# EAGLE design robotito (EAGLE 7.7.0)
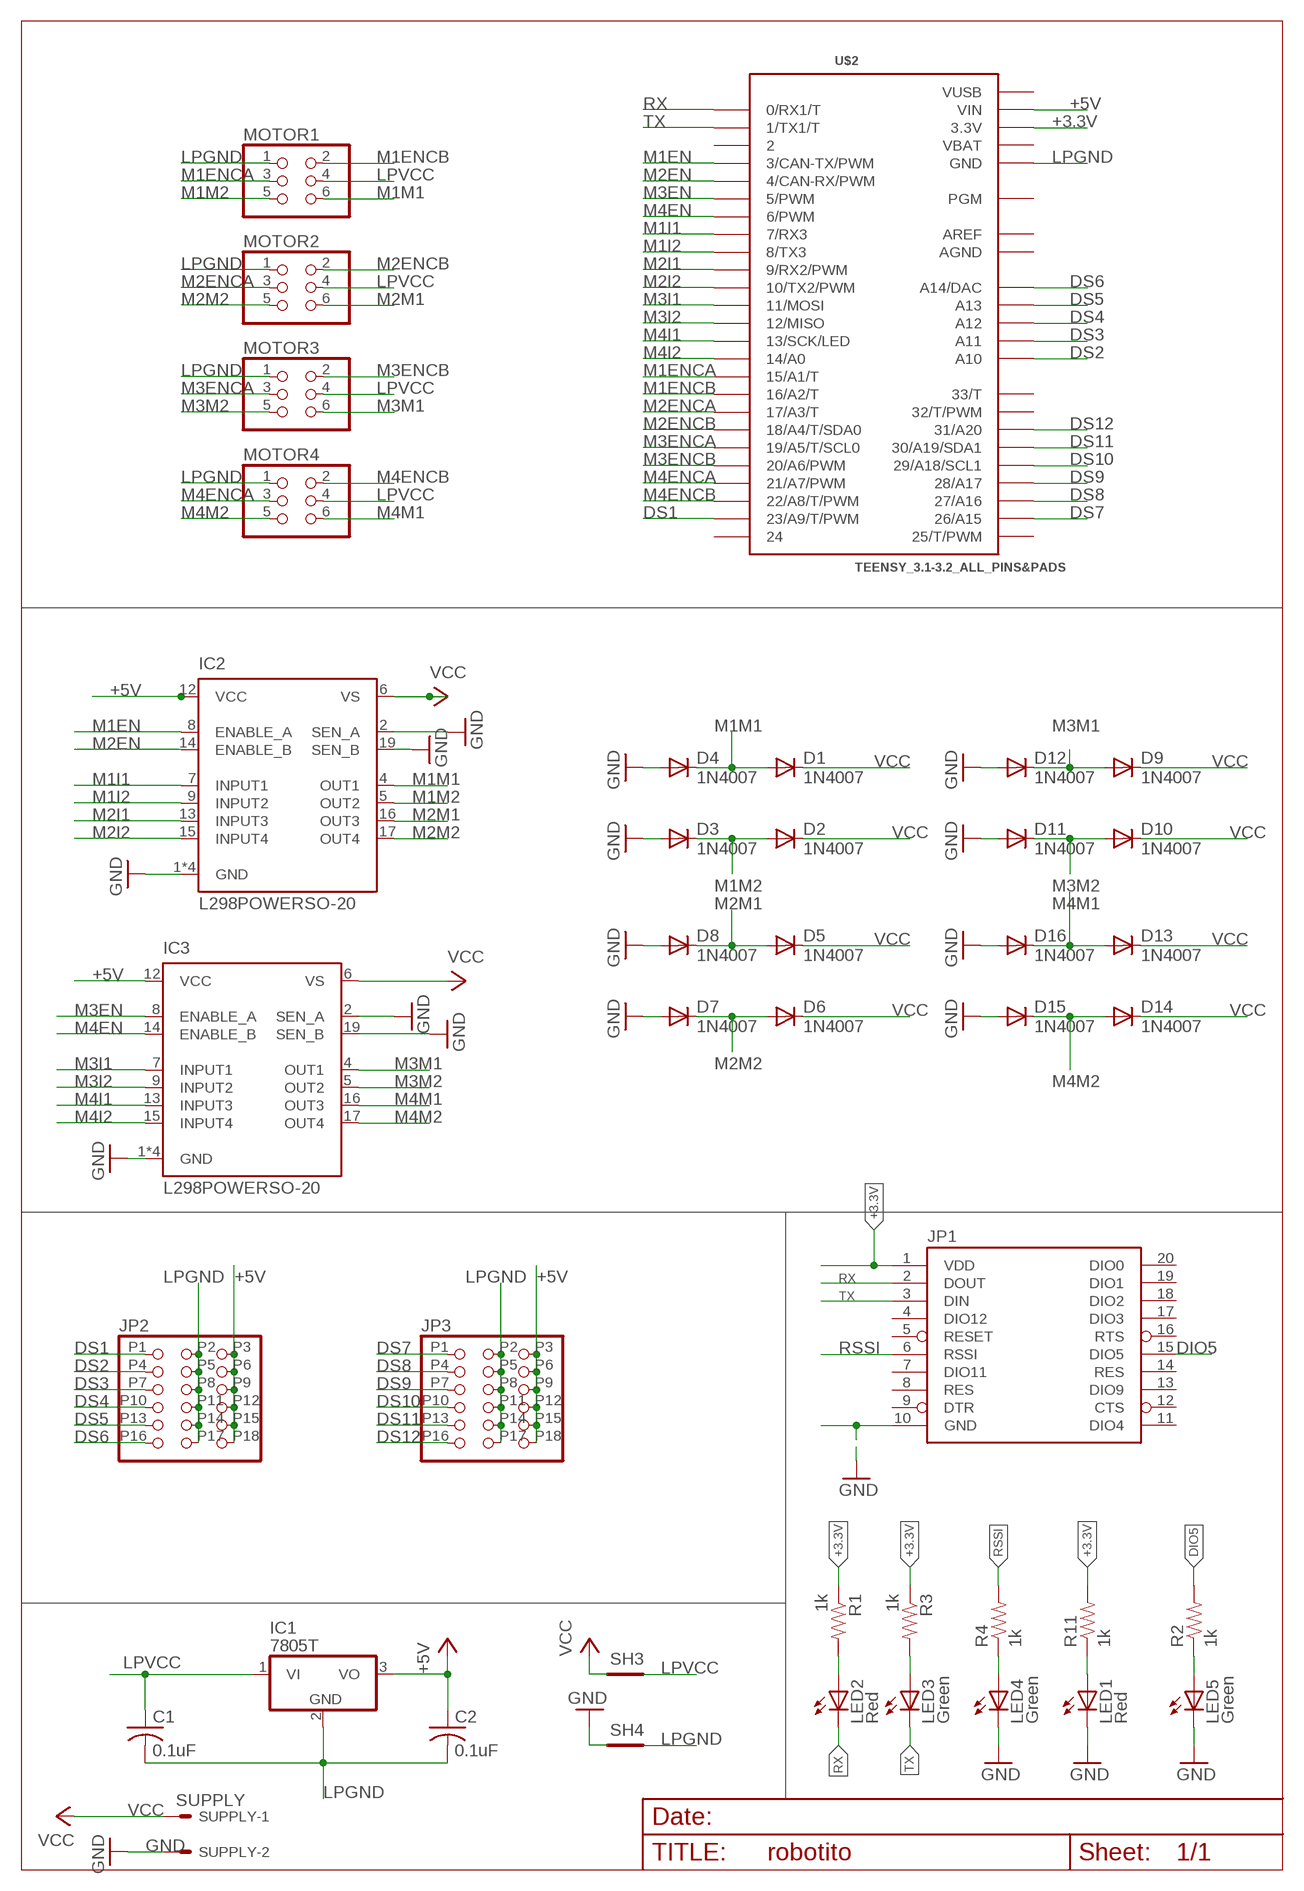
[diagram p0: schematic, sheet 1]

## Parts
C1  0.1uF  C-USC0805  [C0805]
C2  0.1uF  C-USC0805  [C0805]
D1  1N4007  1N4004  [DO41-10]
D2  1N4007  1N4004  [DO41-10]
D3  1N4007  1N4004  [DO41-10]
D4  1N4007  1N4004  [DO41-10]
D5  1N4007  1N4004  [DO41-10]
D6  1N4007  1N4004  [DO41-10]
D7  1N4007  1N4004  [DO41-10]
D8  1N4007  1N4004  [DO41-10]
D9  1N4007  1N4004  [DO41-10]
D10  1N4007  1N4004  [DO41-10]
D11  1N4007  1N4004  [DO41-10]
D12  1N4007  1N4004  [DO41-10]
D13  1N4007  1N4004  [DO41-10]
D14  1N4007  1N4004  [DO41-10]
D15  1N4007  1N4004  [DO41-10]
D16  1N4007  1N4004  [DO41-10]
IC1  7805T  [TO220H]
IC2  L298POWERSO-20  [POWERSO-20]
IC3  L298POWERSO-20  [POWERSO-20]
JP1  XBEE-1B1  [XBEE-1]
JP2  PINHD-2X6  [2X06]
JP3  PINHD-2X6  [2X06]
LED1  Red  LED-RED0603  [LED-0603]
LED2  Red  LED-RED0603  [LED-0603]
LED3  Green  LED-GREEN0603  [LED-0603]
LED4  Green  LED-GREEN0603  [LED-0603]
LED5  Green  LED-GREEN0603  [LED-0603]
MOTOR1  PINHD-2X3  [2X03]
MOTOR2  PINHD-2X3  [2X03]
MOTOR3  PINHD-2X3  [2X03]
MOTOR4  PINHD-2X3  [2X03]
R1  1k  1KOHM1/10W1%(0603)  [0603-RES]
R2  1k  1KOHM1/10W1%(0603)  [0603-RES]
R3  1k  1KOHM1/10W1%(0603)  [0603-RES]
R4  1k  1KOHM1/10W1%(0603)  [0603-RES]
R11  1k  1KOHM1/10W1%(0603)  [0603-RES]
SH3  SHORT-HT5  [SHORT_TOP-50]
SH4  SHORT-HT5  [SHORT_TOP-50]
SUPPLY  SUPPLY  22-27-2021-02  [6410-02]
U$2  TEENSY_3.1-3.2_ALL_PINS&PADS  [TEENSY_3.0-3.2_ALL_PINS_&_PADS]

## Nets
+3.3V: JP1.1(VDD) R1.1 R3.1 R11.2 U$2.3.3V U$2.3.3V1(3.3V) U$2.3.3V2(3.3V)
+5V: C2.1 IC1.3(VO) IC2.12(VCC) IC3.12(VCC) JP2.P3 JP2.P6 JP2.P9 JP2.P12 JP2.P15 JP2.P18 JP3.P3 JP3.P6 JP3.P9 JP3.P12 JP3.P15 JP3.P18 U$2.VIN
DIO5: JP1.15(DIO5) R2.2
DS1: JP2.P1 U$2.23/A9(23/A9/T/PWM)
DS2: JP2.P4 U$2.A10
DS3: JP2.P7 U$2.A11
DS4: JP2.P10 U$2.A12
DS5: JP2.P13 U$2.A13
DS6: JP2.P16 U$2.RESET/DAC(A14/DAC)
DS7: JP3.P1 U$2.26(26/A15)
DS8: JP3.P4 U$2.27(27/A16)
DS9: JP3.P7 U$2.28(28/A17)
DS10: JP3.P10 U$2.29(29/A18/SCL1)
DS11: JP3.P13 U$2.30(30/A19/SDA1)
DS12: JP3.P16 U$2.31(31/A20)
GND [pwr]: D3.A D4.A D7.A D8.A D11.A D12.A D15.A D16.A IC2.1(GND) IC2.2(SEN_A) IC2.10(GND) IC2.11(GND) IC2.19(SEN_B) IC2.20(GND) IC3.1(GND) IC3.2(SEN_A) IC3.10(GND) IC3.11(GND) IC3.19(SEN_B) IC3.20(GND) JP1.10(GND) LED1.C LED4.C LED5.C SH4.1 SUPPLY.2
LPGND: C1.2 C2.2 IC1.2(GND) JP2.P2 JP2.P5 JP2.P8 JP2.P11 JP2.P14 JP2.P17 JP3.P2 JP3.P5 JP3.P8 JP3.P11 JP3.P14 JP3.P17 MOTOR1.1 MOTOR2.1 MOTOR3.1 MOTOR4.1 SH4.2 U$2.GND U$2.GND1(GND) U$2.GND2(GND)
LPVCC: C1.1 IC1.1(VI) MOTOR1.4 MOTOR2.4 MOTOR3.4 MOTOR4.4 SH3.2
M1EN: IC2.8(ENABLE_A) U$2.3(3/CAN-TX/PWM)
M1ENCA: MOTOR1.3 U$2.15/A1(15/A1/T)
M1ENCB: MOTOR1.2 U$2.16/A2(16/A2/T)
M1I1: IC2.7(INPUT1) U$2.7(7/RX3)
M1I2: IC2.9(INPUT2) U$2.8(8/TX3)
M1M1 [pwr]: D1.A D4.C IC2.4(OUT1) MOTOR1.6
M1M2 [pwr]: D2.A D3.C IC2.5(OUT2) MOTOR1.5
M2EN: IC2.14(ENABLE_B) U$2.4(4/CAN-RX/PWM)
M2ENCA: MOTOR2.3 U$2.17/A3(17/A3/T)
M2ENCB: MOTOR2.2 U$2.18/A4(18/A4/T/SDA0)
M2I1: IC2.13(INPUT3) U$2.9(9/RX2/PWM)
M2I2: IC2.15(INPUT4) U$2.10(10/TX2/PWM)
M2M1 [pwr]: D5.A D8.C IC2.16(OUT3) MOTOR2.6
M2M2 [pwr]: D6.A D7.C IC2.17(OUT4) MOTOR2.5
M3EN: IC3.8(ENABLE_A) U$2.5(5/PWM)
M3ENCA: MOTOR3.3 U$2.19/A5(19/A5/T/SCL0)
M3ENCB: MOTOR3.2 U$2.20/A6(20/A6/PWM)
M3I1: IC3.7(INPUT1) U$2.11(11/MOSI)
M3I2: IC3.9(INPUT2) U$2.12(12/MISO)
M3M1: D9.A D12.C IC3.4(OUT1) MOTOR3.6
M3M2 [pwr]: D10.A D11.C IC3.5(OUT2) MOTOR3.5
M4EN: IC3.14(ENABLE_B) U$2.6(6/PWM)
M4ENCA: MOTOR4.3 U$2.21/A7(21/A7/PWM)
M4ENCB: MOTOR4.2 U$2.22/A8(22/A8/T/PWM)
M4I1: IC3.13(INPUT3) U$2.13(13/SCK/LED)
M4I2: IC3.15(INPUT4) U$2.14/A0
M4M1 [pwr]: D13.A D16.C IC3.16(OUT3) MOTOR4.6
M4M2 [pwr]: D14.A D15.C IC3.17(OUT4) MOTOR4.5
N$12: LED1.A R11.1
N$17: LED2.A R1.2
N$19: LED3.A R3.2
N$43: LED4.A R4.1
N$139: LED5.A R2.1
RSSI: JP1.6(RSSI) R4.2
RX: JP1.2(DOUT) LED2.C U$2.0(0/RX1/T)
TX: JP1.3(DIN) LED3.C U$2.1(1/TX1/T)
VCC [pwr]: D1.C D2.C D5.C D6.C D9.C D10.C D13.C D14.C IC2.6(VS) IC3.6(VS) SH3.1 SUPPLY.1
Unconnected: JP1.4(DIO12) JP1.5(RESET) JP1.7(DIO11) JP1.8(RES) JP1.9(DTR) JP1.11(DIO4) JP1.12(CTS) JP1.13(DIO9) JP1.14(RES) JP1.16(RTS) JP1.17(DIO3) JP1.18(DIO2) JP1.19(DIO1) JP1.20(DIO0) U$2.2 U$2.24 U$2.25(25/T/PWM) U$2.32(32/T/PWM) U$2.33(33/T) U$2.PGM

## Power pins joined to a net without a drawn wire
AGND: U$2.AGND
AREF: U$2.AREF
VBAT: U$2.VBAT
VUSB: U$2.VUSB

## Library data of the parts
C1 C2 = adafruit:C-US: CAPACITOR, American symbol
D1-D16 = diode:1N4004: DIODE general purpose rectifier, 1 A
IC1 = linear:78*: Positive VOLTAGE REGULATOR Source: http://cache.national.com/ds/LM/LM78L05.pdf http://www.fairchildsemi.com/ds/LM/LM7805.pdf
IC2 IC3 = mylibrary:L298: DUAL FULL-BRIDGE DRIVER
JP1 = SparkFun-RF:XBEE-1: Xbee module footprints
JP2 JP3 = mylibrary:PINHD-2X6: PIN HEADER
LED1 LED2 = SparkFun-LED:LED-RED: Assorted Red LEDs LilyPad 1206- DIO-09912 1206- DIO-00809 0603- DIO-00819; PROD_ID: DIO-00819; VALUE: RED
LED3-LED5 = SparkFun-LED:LED-GREEN: Various green LEDs Green LEDs used in SFE Production 0603- DIO-00821 LARGE- DIO-00862 LILYPAD- DIO-09910; PROD_ID: DIO-00821; VALUE: GREEN
MOTOR1-MOTOR4 = pinhead:PINHD-2X3: PIN HEADER
R1-R4 R11 = SparkFun-Resistors:1KOHM1/10W1%(0603): RES-07856; PROD_ID: RES-07856; VALUE: 1K
SH3 SH4 = shorts-old:SHORT-H: Short between two nets; BOM: no
SUPPLY = con-molex:22-?-02: CONNECTOR wire to board 2.54 mm (.1 inch) pitch header; OC_FARNELL: unknown; OC_NEWARK: unknown
U$2 = Teensy_3_and_LC_Series_Boards_v1.4:TEENSY_3.1-3.2_ALL_PINS&PADS: Footprint for Teensy 3.1 or 3.2 board using all pads and all through-holes. Pads need a 2x7 0.1" SMD header.

## Net classes
0 default: width 0.254 mm, clearance 0.051 mm
1 pwr: width 1.016 mm, clearance 0.152 mm

## Board
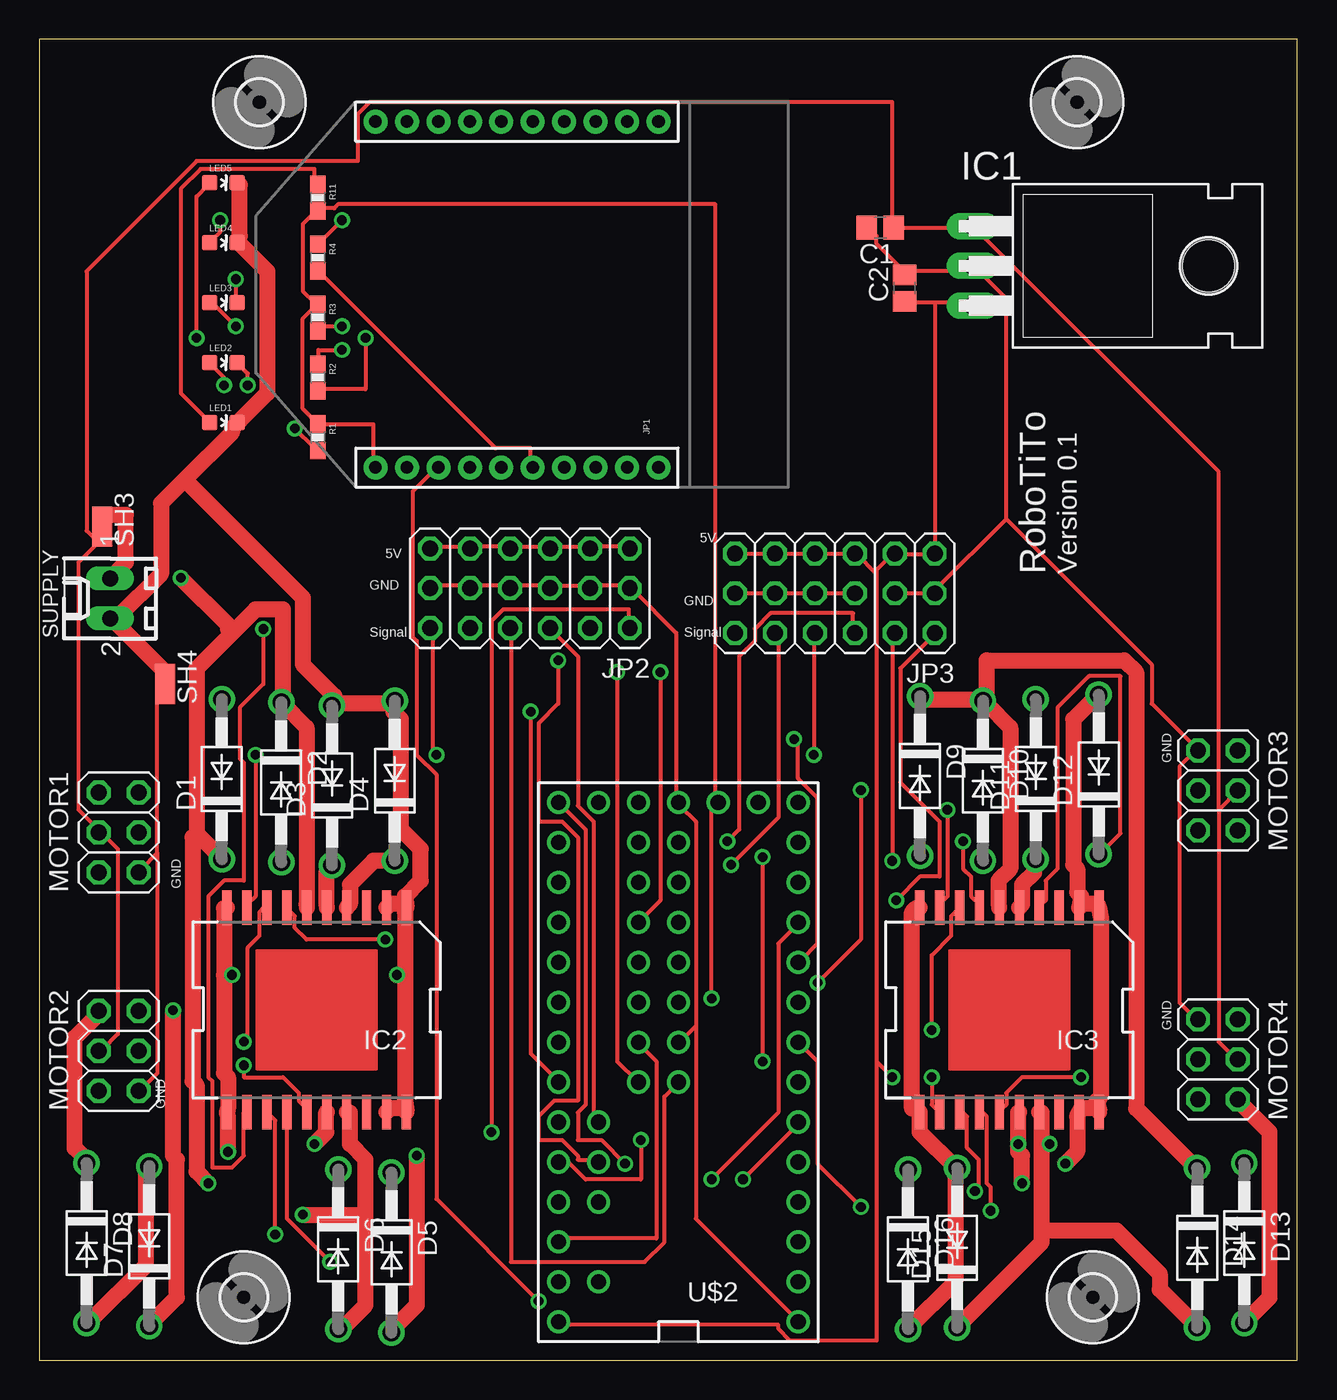
[diagram p1: board, top side]
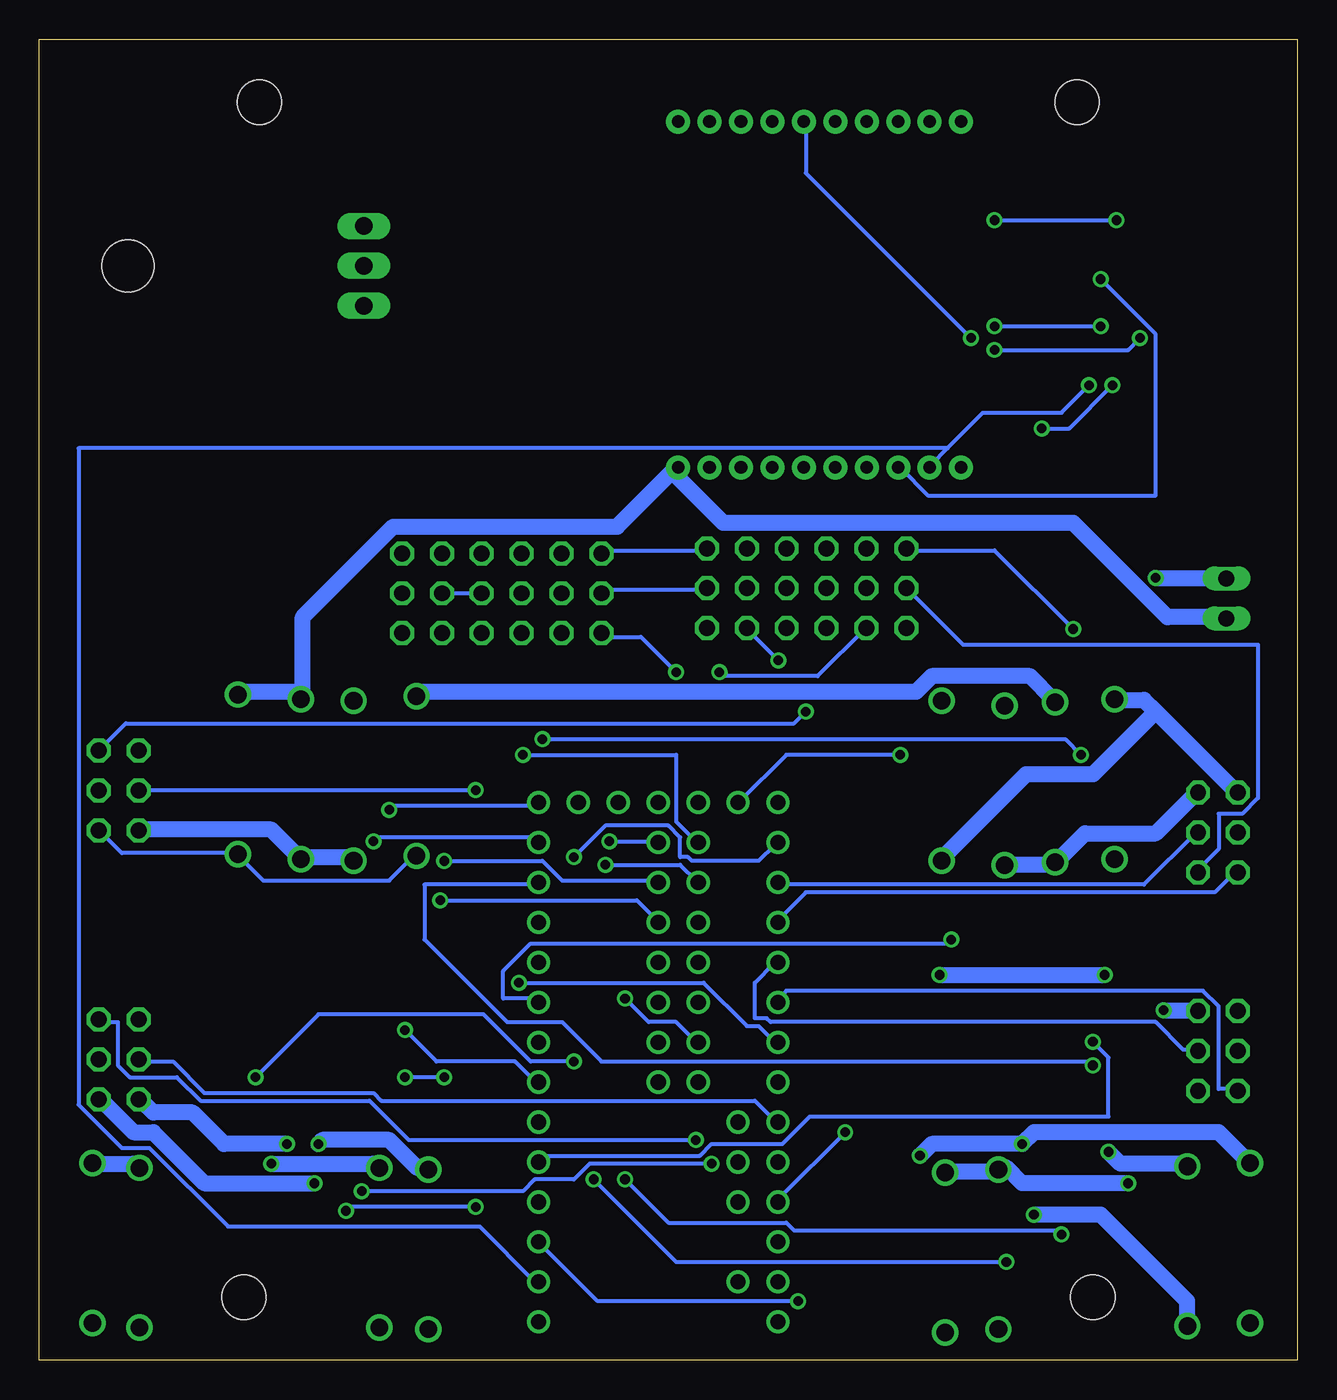
[diagram p2: board, bottom side, seen from below]

Size 80 x 84 mm. Coordinates in mm from the lower left corner, seen from the top.
Outline: 0,0 80,0 80,84 0,84 0,0
Copper layers (1*16): Top 0.035mm / dielectric 1.5mm / Bottom 0.035mm
Design rules "default *": minimum track width 10mil, minimum drill 24mil, track to track 8mil, track to pad 8mil, pad to pad 8mil, via to via 16mil, smd to smd 16mil, copper to edge 40mil, drill to drill 30mil, minimum pad ring 10mil, minimum via ring 8mil, stop-mask expansion 4mil, vias tented up to drill 0mil, thermal gap 10mil

### Footprints (pad centres in the part's own frame; a part is rotated, then mirrored left to right if it is on the bottom)
C0805 = smd 1.3 x 1.5: 1 -0.85,0; 2 0.85,0
DO41-10 = drill 1.118: A 5.08,0; C -5.08,0
TO220H = drill 1.118 long: 1 -2.54,-10.16; 2 0,-10.16; 3 2.54,-10.16 | hole 3.302: 0,4.826
POWERSO-20 = smd 0.6 x 2.2: 1 -5.715,-6.5; 2 -4.445,-6.5; 3 -3.175,-6.5; 4 -1.905,-6.5; 5 -0.635,-6.5; 6 0.635,-6.5; 7 1.905,-6.5; 8 3.175,-6.5; 9 4.445,-6.5; 10 5.715,-6.5; 11 5.715,6.5; 12 4.445,6.5; 13 3.175,6.5; 14 1.905,6.5; 15 0.635,6.5; 16 -0.635,6.5; 17 -1.905,6.5; 18 -3.175,6.5; 19 -4.445,6.5; 20 -5.715,6.5
XBEE-1 = drill 0.8 pad 1.524: 1 -11,20; 2 -11,18; 3 -11,16; 4 -11,14; 5 -11,12; 6 -11,10; 7 -11,8; 8 -11,6; 9 -11,4; 10 -11,2; 11 11,2; 12 11,4; 13 11,6; 14 11,8; 15 11,10; 16 11,12; 17 11,14; 18 11,16; 19 11,18; 20 11,20
2X06 = drill 1.016 octagon: P1 -6.35,1.27; P2 -6.35,-1.27; P3 -6.35,-3.81; P4 -3.81,1.27; P5 -3.81,-1.27; P6 -3.81,-3.81; P7 -1.27,1.27; P8 -1.27,-1.27; P9 -1.27,-3.81; P10 1.27,1.27; P11 1.27,-1.27; P12 1.27,-3.81; P13 3.81,1.27; P14 3.81,-1.27; P15 3.81,-3.81; P16 6.35,1.27; P17 6.35,-1.27; P18 6.35,-3.81
LED-0603 = smd 1 x 1: A 0,-0.877; C 0,0.877
2X03 = drill 1.016 octagon: 1 -2.54,-1.27; 2 -2.54,1.27; 3 0,-1.27; 4 0,1.27; 5 2.54,-1.27; 6 2.54,1.27
0603-RES = smd 1.1 x 1: 1 -0.85,0; 2 0.85,0
SHORT_TOP-50 = smd 1.27 x 1.27: 1 0.635,0; 2 -0.635,0
6410-02 = drill 1.016 long: 1 1.27,0; 2 -1.27,0
2,8 = hole 2.8: 0,0
TEENSY_3.0-3.2_ALL_PINS_&_PADS = drill 0.965: 0 -7.62,13.97; 1 -7.62,11.43; 2 -7.62,8.89; 3 -7.62,6.35; 3.3V 7.62,11.43; 3.3V1 -2.54,-16.51; 3.3V2 2.54,-1.27; 4 -7.62,3.81; 5 -7.62,1.27; 6 -7.62,-1.27; 7 -7.62,-3.81; 8 -7.62,-6.35; 9 -7.62,-8.89; 10 -7.62,-11.43; 11 -7.62,-13.97; 12 -7.62,-16.51; 13 7.62,-16.51; 14/A0 7.62,-13.97; 15/A1 7.62,-11.43; 16/A2 7.62,-8.89; 17/A3 7.62,-6.35; 18/A4 7.62,-3.81; 19/A5 7.62,-1.27; 20/A6 7.62,1.27; 21/A7 7.62,3.81; 22/A8 7.62,6.35; 23/A9 7.62,8.89; 24 0,-3.81; 25 0,-6.35; 26 0,-8.89; 27 0,-11.43; 28 0,-13.97; 29 2.54,-13.97; 30 2.54,-11.43; 31 2.54,-8.89; 32 2.54,-6.35; 33 2.54,-3.81; A10 5.08,6.35; A11 5.08,3.81; A12 0,1.27; A13 2.54,1.27; AGND 7.62,13.97; AREF 5.08,8.89; GND -7.62,16.51; GND1 0,-16.51; GND2 0,-1.27; PGM 2.54,-16.51; RESET/DAC 5.08,-16.51; VBAT -5.08,-16.51; VIN 7.62,16.51; VUSB 5.08,13.97

### Placement (x,y rotation side)
C1  53.48,72.02 180 top
C2  55.02,68.17 90 top
D1  11.61,36.95 90 top
D2  15.39,36.75 270 top
D3  18.61,36.55 90 top
D4  22.61,36.85 90 top
D5  22.39,6.85 270 top
D6  19.01,7.05 270 top
D7  6.99,7.25 90 top
D8  3.01,7.45 270 top
D9  56.01,37.15 270 top
D10  60.01,36.85 270 top
D11  63.37,36.95 90 top
D12  67.37,37.25 90 top
D13  76.63,7.45 270 top
D14  73.63,7.15 270 top
D15  58.37,7.15 90 top
D16  55.25,7.05 270 top
IC1  69.53,69.59 270 top
IC2  17.64,22.28 180 top
IC3  61.69,22.28 180 top
JP1  41.38,67.77 90 top
JP2  31.2,47.82 180 top
JP3  50.59,47.5 180 top
LED1  11.71,59.64 270 top
LED2  11.71,63.45 270 top
LED3  11.71,67.26 270 top
LED4  11.71,71.07 270 top
LED5  11.71,74.88 270 top
MOTOR1  5.04,33.55 90 top
MOTOR2  5.04,19.66 90 top
MOTOR3  74.96,36.23 270 top
MOTOR4  74.96,19.12 270 top
R1  17.71,58.69 270 top
R2  17.71,62.5 270 top
R3  17.71,66.31 270 top
R4  17.71,70.12 270 top
R11  17.71,73.93 270 top
SH3  4,53 90 top
SH4  8,43 90 top
SUPPLY  4.5,48.44 90 top
U$1  [2,8]  13,4 0 top
U$2  40.64,18.95 180 top
U$3  [2,8]  67,4 0 top
U$4  [2,8]  14,80 0 top
U$5  [2,8]  66,80 0 top

### Tracks (layer width: path | path; a pad name or v marks a point on that pad's centre or on a via)
+3.3V  (via drill 0.61)
  Top 0.254: JP1.1 21.25,57 21.25,59.5 17.75,59.5 R1.1 16.75,60.5 16.75,66.25 17.5,67 R3.1 17.5,67.25 16.75,68 16.75,72.25 17.5,73 R11.2 17.75,73.25 18.75,73.25 19,73.5 43,73.5 43,35.5 U$2.3.3V1 43,35.25 42.75,35 v42.75,23 | U$2.3.3V 33.25,7.75 39.25,7.75 39.25,19 38.25,20 U$2.3.3V2
  Bottom 0.254: v42.75,23 41.25,21.5 39.5,21.5 38.25,20.25 U$2.3.3V2
+5V  (via drill 0.61)
  Top 0.254: JP2.P3 37.5,51.75 35.25,51.75 JP2.P6 35,51.75 32.5,51.75 JP2.P9 32.25,51.75 30,51.75 JP2.P12 29.75,51.75 27.5,51.75 JP2.P15 27.25,51.75 25,51.75 JP2.P18 | v14.25,46.5 14.25,43 12.75,41.5 12.75,38.25 13,38 13,30.5 11.75,30.5 10.75,29.5 10.75,18 11,17.75 11,12.25 12.25,12.25 13,13 13,15.75 IC2.12 | JP3.P18 44.25,51.25 46.75,51.25 JP3.P15 47,51.25 49.25,51.25 JP3.P12 49.5,51.25 51.75,51.25 JP3.P9 52,51.25 53.25,50 | 57,67.25 59.25,67.25 IC1.3 | 57,67.25 55.25,67.25 C2.1 | v56.75,18 56.75,16.25 57,16 IC3.12 | 53.25,19 v54.25,18 | 53.25,50 53.25,50.25 54.25,51.25 JP3.P6 54.5,51.25 56.75,51.25 JP3.P3 57,51.5 57,67.25 | 53.25,50 53.25,19 | 53.25,19 53.25,1.25 47.75,1.25 47,2 47,2.25 33.25,2.25 U$2.VIN
  Bottom 0.254: v14.25,46.5 19.25,51.5 24.75,51.5 JP2.P18 | v54.25,18 v56.75,18 | JP2.P3 37.75,51.5 44,51.5 JP3.P18
DIO5  (via drill 0.61)
  Top 0.254: v20.75,65 20.75,61.75 17.75,61.75 R2.2
  Bottom 0.254: v20.75,65 31.25,75.5 31.25,78.75 JP1.15
DS1  (via drill 0.61)
  Top 0.254: v28.75,14.5 28.75,47 29.5,47.75 37.5,47.75 37.5,46.75 JP2.P1
  Bottom 0.254: v28.75,14.5 33,10.25 U$2.23/A9
DS2  (via drill 0.61)
  Top 0.254: v33,44.5 33,41.75 31.75,40.5 31.75,34.25 33.25,34.25 34.25,33.25 34.25,16.5 32.75,16.5 31.75,15.5 31.75,14 33.25,14 34.25,13 34.25,12.75 35.5,12.75 U$2.A10
  Bottom 0.254: v33,44.5 35,46.5 JP2.P4
DS3
  Top 0.254: U$2.A11 35.5,15.25 35.25,15.5 35.25,34.25 34.25,35.25 34.25,44.75 32.5,46.5 JP2.P7
DS4
  Top 0.254: U$2.A12 40.5,17.5 39.75,16.75 39.75,7.5 38.5,6.25 30,6.25 30,46.5 JP2.P10
DS5  (via drill 0.61)
  Top 0.254: v36.75,43.75 36.75,19 38,17.75 U$2.A13
  Bottom 0.254: v36.75,43.75 36.5,43.5 30.5,43.5 27.5,46.5 JP2.P13
DS6  (via drill 0.61)
  Top 0.254: v25.25,38.5 25,38.75 25,46.5 JP2.P16
  Bottom 0.254: v25.25,38.5 32.5,38.5 35.5,35.5 U$2.RESET/DAC
DS7  (via drill 0.61)
  Top 0.254: v54.5,29.25 56,30.75 57.25,30.75 57.25,34.25 54.75,36.75 54.75,44 56.75,46 JP3.P1
  Bottom 0.254: v54.5,29.25 42,29.25 40.75,28 U$2.26
DS8  (via drill 0.61)
  Top 0.254: v54.25,31.75 54.25,46 JP3.P4
  Bottom 0.254: v54.25,31.75 48,31.75 46.75,30.5 40.75,30.5 U$2.27
DS9  (via drill 0.61)
  Top 0.254: v43.75,33 44.5,33.75 44.5,44.75 45.5,45.75 45.5,46.5 46.5,47.5 51.75,47.5 51.75,46.25 JP3.P7
  Bottom 0.254: v43.75,33 40.75,33 U$2.28
DS10  (via drill 0.61)
  Top 0.254: v49.25,38.5 49.25,46 JP3.P10
  Bottom 0.254: v49.25,38.5 39.5,38.5 39.5,34.25 38.25,33 U$2.29
DS11  (via drill 0.61)
  Top 0.254: v44,31.5 47,34.5 47,46 JP3.P13
  Bottom 0.254: v44,31.5 39.25,31.5 38.25,30.5 U$2.30
DS12  (via drill 0.61)
  Top 0.254: v39.5,43.75 39.5,29.25 38.25,28 U$2.31
  Bottom 0.254: v39.5,43.75 41.75,46 44,46 JP3.P16
GND  (via drill 0.61)
  Top 1.016: IC3.10 55.75,28.75 55.5,28.5 55.5,16 IC3.11 56,15.75 56,14.5 58.25,12.25 D15.A 58.25,11.75 58.25,5 55.25,2 D16.A | D12.A 67.25,42.25 65.75,40.75 65.75,31.5 66,31.25 66,29.75 66.25,29.5 IC3.2 66.25,29 67.25,29 IC3.1 67.5,28.25 67.5,16.75 67.25,16.5 IC3.20 67.25,16 66.25,16 IC3.19 66,15.5 66,13.25 v65.25,12.5 | 11.75,24.5 11.75,28.75 IC2.10 | 11.75,24.5 11.75,18.25 12,18 12,16 IC2.11 12,15.5 v12,13.25 | D8.A 3.25,2.5 6.75,6 6.75,12.25 D7.A | IC2.19 22.25,16 23.25,16 IC2.20 23.25,16.5 23.25,24.5 | IC2.2 22.25,29 23.25,29 IC2.1 | 23.25,24.5 23.25,28.5 IC2.1 | IC2.1 23.25,29.5 24.25,30.5 24.25,32.5 23,33.75 23,40.75 22.5,41.25 D4.A 22.5,41.75 18.75,41.75 D3.A 18.75,42.25 16.75,44.25 16.75,48.5 9.25,56 | SH4.1 8,43.75 4.5,47.25 SUPPLY.2 5,47.25 7.75,50 7.75,54.5 9.25,56 | LED5.C 12.75,74.75 12.75,71.5 LED4.C 12.75,71 14.5,69.25 14.5,61.5 12.75,59.75 LED1.C 12.25,59.25 12.25,59 9.25,56 | v12.25,24.5 11.75,24.5 | v22.75,24.5 23.25,24.5
  Bottom 1.016: D12.A 67.25,42.5 63.75,42.5 D11.A 63.25,42.25 63.25,47.25 57.5,53 43.25,53 39.5,56.75 JP1.10 39.5,56.25 36.5,53.25 14.25,53.25 8.25,47.25 4.5,47.25 SUPPLY.2 | v65.25,12.5 58.75,12.5 58.5,12.25 D15.A | v12,13.25 11.25,12.5 7,12.5 D7.A | v22.75,24.5 v12.25,24.5
LPGND
  Top 0.254: 41.75,21.25 40.75,20.25 U$2.GND2 | 41.75,21.25 41.75,34.25 40.75,35.25 U$2.GND1 40.5,35.5 40.5,46.25 37.75,49 JP2.P2 37.5,49.25 35.25,49.25 JP2.P5 35,49.25 32.5,49.25 JP2.P8 32.25,49.25 30,49.25 JP2.P11 29.75,49.25 27.5,49.25 JP2.P14 27.25,49.25 25,49.25 JP2.P17 | 41.75,21.25 41.75,9 48.25,2.5 U$2.GND | 7.5,32.25 7.5,41.75 8,42.25 SH4.2 | 7.5,32.25 6.5,31.25 MOTOR1.1 | 7.5,32.25 7.5,18.25 6.5,17.25 MOTOR2.1 | MOTOR4.1 73.5,21.75 72.5,22.75 72.5,37.75 73.5,38.75 MOTOR3.1 73.5,39 70.75,41.75 70.75,44.25 61.5,53.5 | C1.2 52.75,72 53.25,71.5 53.25,71 55,69.25 C2.2 55.25,69.25 59.25,69.25 59.25,69.5 IC1.2 59.5,69.5 61.5,67.5 61.5,53.5 | JP3.P5 54.5,48.75 56.75,48.75 JP3.P2 57,49 61.5,53.5 | JP3.P17 44.25,48.75 46.75,48.75 JP3.P14 47,48.75 49.25,48.75 JP3.P11 49.5,48.75 51.75,48.75 JP3.P8
  Bottom 0.254: JP3.P5 54.25,48.75 52,48.75 JP3.P8 | JP2.P2 37.75,49 44,49 JP3.P17 | MOTOR1.1 6.25,31.25 5,32.5 5,34.75 3.5,34.75 2.5,35.75 2.5,45.5 21.25,45.5 24.75,49 JP2.P17
LPVCC
  Top 0.254: 3.75,52 2.5,50.75 2.5,35 3.75,33.75 MOTOR1.4 4,33.5 5,32.5 5,20.75 4,19.75 MOTOR2.4 | 3.75,52 4,52.25 SH3.2 3.75,52 | 75,35 75,20.25 76,19.25 MOTOR4.4 | MOTOR3.4 75,35 | 75,35 75,56.5 IC1.1 59.25,72 54.5,72 C1.1 54.25,72.25 54.25,80 21,80 20.25,79.25 20.25,76.25 10,76.25 3,69.25 3,52.75 3.75,52
M1EN  (via drill 0.61)
  Top 0.254: v13,20.25 13.25,20.5 13.25,26.25 14,27 14,28.5 14.25,28.75 IC2.8
  Bottom 0.254: v13,20.25 12,19.25 12,15.5 31,15.5 32.75,13.75 37.25,13.75 38,13 48,13 48.25,12.75 U$2.3
M1ENCA
  Bottom 0.254: U$2.15/A1 33,30.25 9.75,30.25 6.5,33.5 MOTOR1.3
M1ENCB
  Bottom 0.254: U$2.16/A2 33,28 31.25,29.75 5.25,29.75 4,31 MOTOR1.2
M1I1  (via drill 0.61)
  Top 0.254: v22,26.75 17,26.75 16.25,27.5 16.25,28.25 15.75,28.75 IC2.7
  Bottom 0.254: v22,26.75 22.25,26.5 48.75,26.5 50.5,24.75 50.5,23 48.5,23 U$2.7
M1I2  (via drill 0.61)
  Top 0.254: v13.75,38.5 13.75,29.5 13.25,29 IC2.9 | v48,39.5 48.25,39.25 48.25,37 49.5,35.75 49.5,26.5 48.5,25.5 U$2.8
  Bottom 0.254: v13.75,38.5 14.75,39.5 v48,39.5
M1M1
  Top 1.016: IC2.4 19.75,29 19.75,30.25 21.25,31.75 22.5,31.75 D4.C
  Bottom 1.016: 9,41.25 9.75,42 11.5,42 D1.A | 9,41.25 4,36.25 MOTOR1.6 | 9,41.25 13,37.25 17.25,37.25 22.5,32 D4.C
M1M2
  Top 1.016: IC2.5 18.25,29 18.25,31 18.5,31.25 D3.C
  Bottom 1.016: MOTOR1.5 6.5,36 9,33.5 13.5,33.5 15.25,31.75 D2.A 15.75,31.5 18.5,31.5 D3.C
M2EN  (via drill 0.61)
  Top 0.254: v18.5,6.25 15.75,9 15.75,15.75 IC2.14 | v44.75,11.5 48.25,15 U$2.4
  Bottom 0.254: v18.5,6.25 39.5,6.25 v44.75,11.5
M2ENCA
  Bottom 0.254: U$2.17/A3 33.25,25.25 34.5,24 34.5,21.75 33.75,21.75 33.5,21.5 9,21.5 7.25,19.75 6.5,19.75 MOTOR2.3
M2ENCB
  Bottom 0.254: U$2.18/A4 33,23 32.5,23.5 6,23.5 5,22.5 5,17.25 4,17.25 MOTOR2.2
M2I1  (via drill 0.61)
  Top 0.254: v15,8 15,15.25 14.5,15.75 IC2.13 | v42.75,11.5 47,15.75 47,26.5 48.25,27.75 U$2.9
  Bottom 0.254: v15,8 15.25,8.25 32,8.25 32.5,8.75 40,8.75 v42.75,11.5
M2I2  (via drill 0.61)
  Top 0.254: v13,18.75 13,18 15.5,18 16.5,17 16.5,16.5 17,16 IC2.15
  Bottom 0.254: v13,18.75 13.25,19 44.25,19 46.75,21.5 50.25,21.5 55.5,26.75 55.5,30.25 48.5,30.25 U$2.10
M2M1  (via drill 0.61)
  Top 1.016: v17.5,13.75 18.25,14.5 18.25,15.75 IC2.16 | MOTOR2.6 3.75,22 2.25,20.5 2.25,13.5 3,12.75 D8.C | v24,13 24,3.5 22.5,2 D5.A
  Bottom 1.016: D8.C 3.25,12.75 5,14.5 16.75,14.5 v17.5,13.75 23.25,13.75 v24,13
M2M2  (via drill 0.61)
  Top 1.016: 20.75,9.25 20.75,3.5 19.25,2 D6.A | 20.75,9.25 20.75,12.75 19.75,13.75 19.75,15.75 IC2.17 | v8.5,22.25 8.5,13 8.75,12.75 8.75,4 7,2.25 D7.C | v16.75,9.25 20.75,9.25
  Bottom 1.016: v8.5,22.25 6.5,22.25 MOTOR2.5 | v16.75,9.25 12.5,9.25 7,3.75 7,2.25 D7.C
M3EN  (via drill 0.61)
  Top 0.254: v56.75,21 56.75,25.75 58,27 58,28.25 58.5,28.75 IC3.8
  Bottom 0.254: v56.75,21 54.75,19 49.75,19 48.5,17.75 U$2.5
M3ENCA  (via drill 0.61)
  Top 0.254: v49.5,24 52.25,26.75 v52.25,36.25
  Bottom 0.254: v49.5,24 37.75,24 35,21.25 34.25,21.25 33.25,20.25 U$2.19/A5 | v52.25,36.25 73.5,36.25 MOTOR3.3
M3ENCB  (via drill 0.61)
  Top 0.254: v31.25,41.25 31.25,19.5 33,17.75 U$2.20/A6
  Bottom 0.254: v31.25,41.25 32,40.5 74.5,40.5 MOTOR3.2
M3I1  (via drill 0.61)
  Top 0.254: v58.75,33 58.75,31.25 59.25,30.75 59.25,29.5 59.75,29 IC3.7
  Bottom 0.254: v58.75,33 58.5,33.25 48.75,33.25 48.5,33 U$2.11
M3I2  (via drill 0.61)
  Top 0.254: v57.75,35 57.75,29.5 57.25,29 IC3.9
  Bottom 0.254: v57.75,35 57.5,35.25 48.5,35.25 U$2.12
M3M1
  Top 0.254: IC3.4 63.75,29 64,29.25 64,30.5 64.75,31.25 64.75,41.5 66.75,43.5 68.75,43.5 68.75,33.5 67.5,32.25 D12.C
  Bottom 0.254: MOTOR3.6 76,33.5 74.75,32.25 67.5,32.25 D12.C 67.25,32 65.75,30.5 57.75,30.5 56.25,32 D9.A
M3M2
  Top 1.016: IC3.5 62.5,29 62.5,30.25 63.25,31 63.25,31.75 D11.C
  Bottom 1.016: MOTOR3.5 73.5,33.75 65.25,33.75 D11.C 63,32 60.25,32 D10.A
M4EN  (via drill 0.61)
  Top 0.254: v60.5,9.5 60.5,11 60.25,11.25 60.25,15.5 60,15.75 IC3.14 | v52.25,9.75 49.5,12.5 49.5,19 48.5,20 U$2.6
  Bottom 0.254: v60.5,9.5 60.25,9.75 v52.25,9.75
M4ENCA
  Bottom 0.254: U$2.21/A7 33.25,15.25 34.5,16.5 58.25,16.5 58.75,17 69.5,17 71.5,19 73.5,19 MOTOR4.3
M4ENCB  (via drill 0.61)
  Top 0.254: v38.25,14 38.25,11.5 34.75,11.5 33.75,12.5 33.25,12.5 U$2.22/A8
  Bottom 0.254: v38.25,14 56.5,14 59,16.5 69.75,16.5 71.25,18 74.25,18 75,18.75 75,21.5 76,21.5 MOTOR4.2
M4I1  (via drill 0.61)
  Top 0.254: v59.5,10.75 59.75,11 59.75,12.75 59,13.5 59,15.5 58.75,15.75 IC3.13 | v37.25,12.5 35.75,14 34.25,14 34.25,15.75 34.75,16.25 34.75,33.75 33.25,35.25 U$2.13
  Bottom 0.254: v59.5,10.75 49.25,10.75 48.5,11.5 46,11.5 45,12.5 v37.25,12.5
M4I2  (via drill 0.61)
  Top 0.254: v66.25,18 62.5,18 61.5,17 61.5,16.25 61.25,16 IC3.15 | v46,32 v46,19
  Bottom 0.254: v66.25,18 62.25,22 51.75,22 48.75,19 v46,19 | v46,32 44,34 40,34 39.25,33.25 39.25,32 38.75,32 38.5,31.75 34.25,31.75 33.25,32.75 U$2.14/A0
M4M1  (via drill 0.61)
  Top 1.016: IC3.16 62.25,15.75 v62.25,13.75 62.25,13.25 62.5,13 v62.5,11.25 | MOTOR4.6 76.25,16.5 78.25,14.5 78.25,4 76.75,2.5 D13.A
  Bottom 1.016: v62.25,13.75 62,14 57.75,14 56,12.25 55.25,12.25 D16.C | v62.5,11.25 69.5,11.25 72.75,14.5 74,14.5 76,16.5 MOTOR4.6
M4M2  (via drill 0.61)
  Top 1.016: 63.75,8.25 63.75,7.5 58.5,2.25 D15.C | 63.75,8.25 63.75,13.75 | 63.75,13.75 63.75,15.75 IC3.17 | v64.25,13.75 63.75,13.75 | 63.75,8.25 68.5,8.25 71.25,5.5 71.25,4.5 73.5,2.25 D14.A
  Bottom 1.016: v64.25,13.75 68.25,13.75 70.25,15.75 72.75,15.75 73.5,16.5 MOTOR4.5
N$12
  Top 0.254: LED1.A 10.75,59.75 9,61.5 9,74.5 10.25,75.75 17.5,75.75 17.5,75 R11.1
N$17  (via drill 0.61)
  Top 0.254: v11.75,62 11.75,62.5 11,63.25 LED2.A | v16.25,59.25 17.5,58 R1.2
  Bottom 0.254: v11.75,62 14.5,59.25 v16.25,59.25
N$19  (via drill 0.61)
  Top 0.254: v12.5,65.75 11,67.25 LED3.A | v19.25,65.75 17.75,65.75 17.75,65.5 R3.2
  Bottom 0.254: v19.25,65.75 v12.5,65.75
N$43  (via drill 0.61)
  Top 0.254: v11.5,72.5 11.5,71.75 11,71.25 LED4.A | v19.25,72.5 17.75,71 R4.1
  Bottom 0.254: v19.25,72.5 v11.5,72.5
N$139  (via drill 0.61)
  Top 0.254: v10,65 10,74 10.75,74.75 LED5.A | v19.25,64.25 17.75,64.25 17.75,63.5 R2.1
  Bottom 0.254: v10,65 10.75,64.25 v19.25,64.25
RSSI
  Top 0.254: R4.2 17.75,69.25 29,58 31.25,58 31.25,57 JP1.6
RX  (via drill 0.61)
  Top 0.254: v13.25,62 13.25,62.75 12.75,63.25 LED2.C
  Bottom 0.254: v13.25,62 15,60.25 20,60.25 22.25,58 | 22.25,58 23.25,57 JP1.2 | 22.25,58 77.5,58 77.5,16.25 74.75,13.5 73,13.5 68,8.5 52,8.5 48.5,5 U$2.0
TX  (via drill 0.61)
  Top 0.254: v12.5,68.75 12.5,67.5 LED3.C | v31.75,3.75 25.25,10.25 25.25,37.25 24,38.5 24,45.75 23.75,46 23.75,55.25 25.25,56.75 JP1.3
  Bottom 0.254: v12.5,68.75 9,65.25 9,55 23.5,55 25.25,56.75 JP1.3 | v31.75,3.75 44.5,3.75 48.25,7.5 U$2.1
VCC  (via drill 0.61)
  Top 1.016: IC3.6 61,29 61,30.5 61.75,31.25 61.75,40.25 60.25,41.75 D10.C | D9.C 56.25,42 59.5,42 D10.C | D14.C 73.5,12.25 69.75,16 69.75,43.75 69,44.5 60.25,44.5 60.25,42.25 D10.C | SH3.1 4,53.75 5.5,53.75 5.5,50.75 4.5,49.75 SUPPLY.1 | IC2.6 17,29 17,40.25 15.5,41.75 D2.C 15.5,42.25 15.5,47.75 13.75,47.75 12.25,46.25 | 10,33.5 11.5,32 D1.C | 10,33.5 10,44 12.25,46.25 | v9,49.75 12,46.75 12,46.5 12.25,46.25 | v10.75,11.25 10,12 10,17.5 9.75,17.75 9.75,33.25 10,33.5
  Bottom 1.016: D14.C 73.75,12.25 74,12.5 76.5,12.5 D13.C | D5.C 22.25,12 19.25,12 D6.C 18.5,12.25 17.5,11.25 v10.75,11.25 | v9,49.75 4.5,49.75 SUPPLY.1 | D9.C 56,42.25 55.75,42.5 24.25,42.5 23.25,43.5 17,43.5 15.5,42 D2.C

### Text on the board
tNames: 5V | 5V | RoboTiTo | Version 0.1 | GND | GND | Signal | Signal | GND | GND | GND | GND